# Altium schematic sheet Programmer.SchDoc: Programmer
size A; Author: Micheal Burin; Revision: 1.0; SheetNumber: 4; SheetTotal: 10
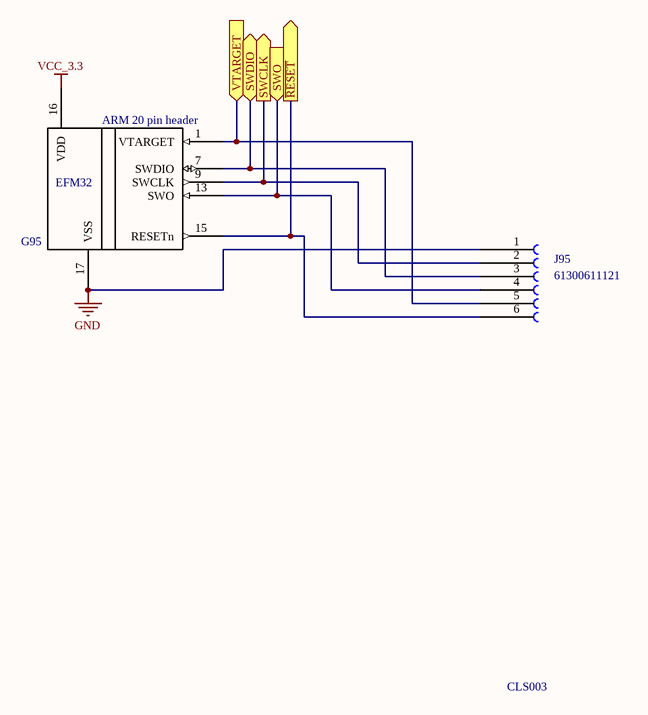
[diagram p0: Programmer.SchDoc]

## Parts
G95  Gecko_Debug_Board_Connection  (value not drawn)
J95  61300611121  [61300611121]

## Ports
SWCLK (out), SWDIO (bidir), SWO (in), VTARGET (in), ~{RESET} (out)

## Nets
GND: G95.17(VSS) J95.1
VCC_3.3: G95.16(VDD)
~{RESET}: G95.15(RESETn) J95.6 ; port ~{RESET}
SWCLK: G95.9(SWCLK) J95.2 ; port SWCLK
SWDIO: G95.7(SWDIO) J95.3 ; port SWDIO
SWO: G95.13(SWO) J95.4 ; port SWO
VTARGET: G95.1(VTARGET) J95.5 ; port VTARGET

## Notes on the sheet
- CLS003
- (in symbol Gecko_Debug_Board_Connection) ARM 20 pin header; EFM32

## Library data of the parts
G95 = Gecko_Debug_Board_Connection: Leopard Gecko Debug; Vendor Part Number: ECOT 435; Manufacturer Part Number: EFM32LG-STK3600; Vendor: Professor Graham; Vendor Description: Leopard Gecko Board; ComponentLink1Description: *; ComponentLink1URL: *; Cost: 0; Manufacturer: *
J95 = 61300611121: Board-To-Board Connector, Vertical, WR-PHD Series, Through Hole, Header, 6, 2.54 mm; Manufacturer: CONN HEADER 6 POS 2.54; Vendor Part Number: 732-5319-ND; Vendor: Digikey; Vendor Description: CONN HEADER 6 POS 2.54 x2; Value: *; ComponentLink1Description: Datasheet; ComponentLink1URL: https://www.digikey.com/products/en?keywords=732-5319-ND; Cost: .33; Manufacturer Part Number: 61300611121